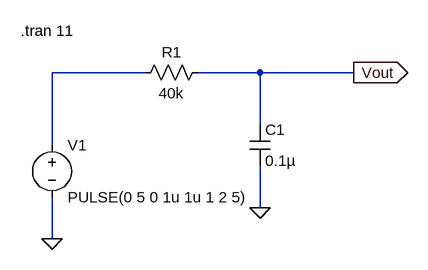
[diagram p0: schematic RC.asc]
RC.asc, the LTspice schematic file:
Version 4
SHEET 1 880 680
WIRE 240 192 96 192
WIRE 416 192 320 192
WIRE 560 192 416 192
WIRE 416 272 416 192
WIRE 96 304 96 192
WIRE 416 400 416 336
WIRE 96 448 96 384
FLAG 96 448 0
FLAG 416 400 0
FLAG 560 192 Vout
IOPIN 560 192 Out
SYMBOL voltage 96 288 R0
SYMATTR InstName V1
SYMATTR Value PULSE(0 5 0 1u 1u 1 2 5)
SYMBOL res 336 176 R90
WINDOW 0 0 56 VBottom 2
WINDOW 3 32 56 VTop 2
SYMATTR InstName R1
SYMATTR Value 40k
SYMBOL cap 400 272 R0
SYMATTR InstName C1
SYMATTR Value 0.1µ
TEXT 48 128 Left 2 !.tran 11

The netlist it stands for:
* RC.asc
V1 N001 0 PULSE(0 5 0 1u 1u 1 2 5)
R1 Vout N001 40k
C1 Vout 0 0.1µ
.tran 11
.backanno
.end